# Altium schematic sheet AMS_Solar.SchDoc
size A
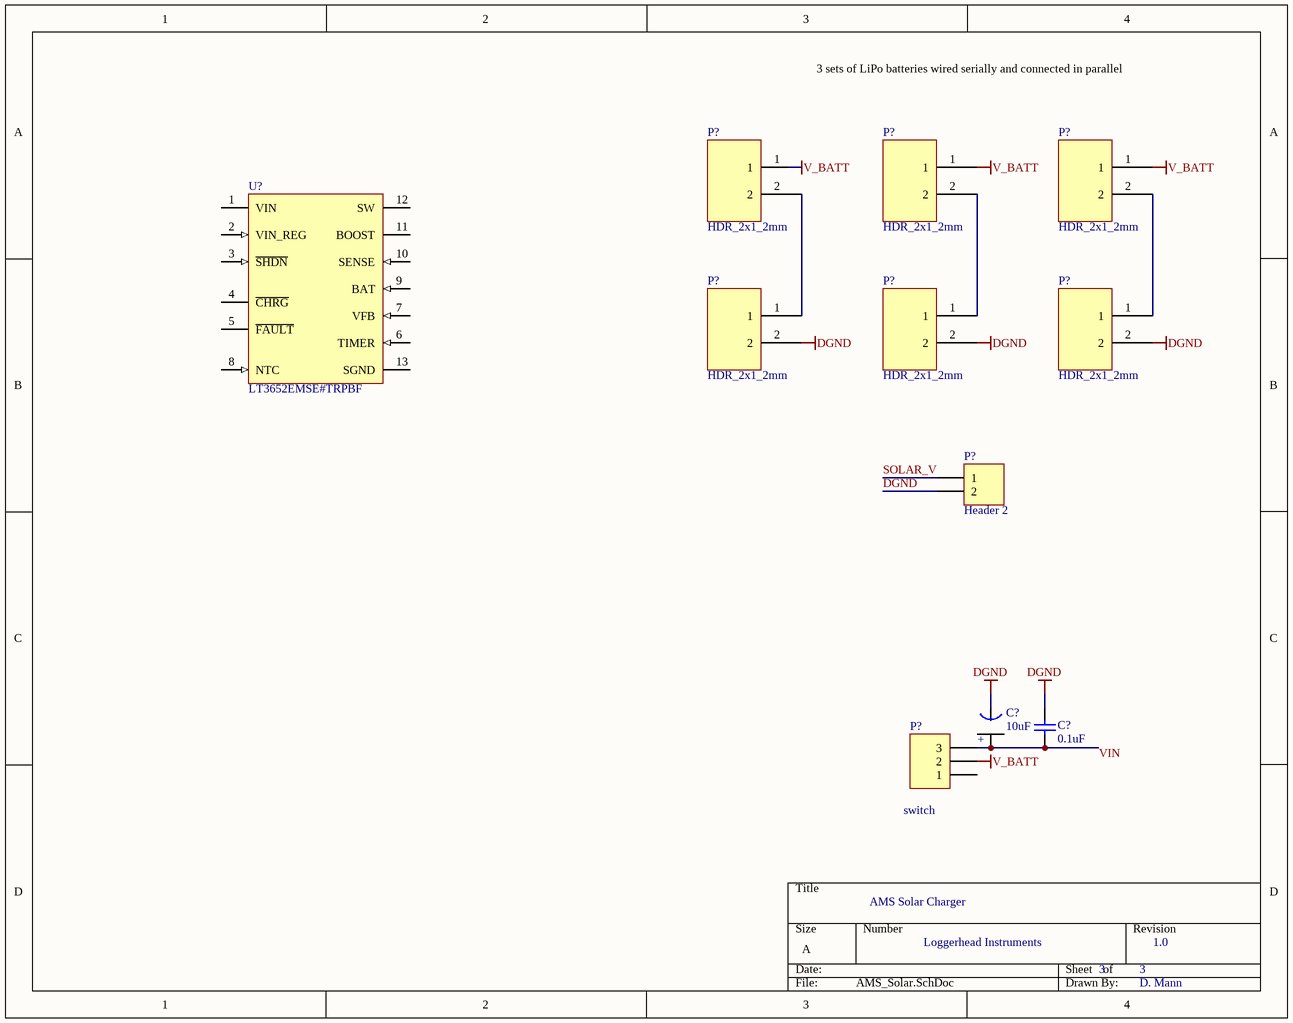
[diagram p0: AMS_Solar.SchDoc]

## Parts
(Parts that share a designator on the sheet are numbered #1, #2 ... from top to bottom, then left to right.)
C?#1  0.1uF  [0402]
C?#2  10uF  [Tant0805]
P?#1  HDR_2x1_2mm  [HDR_2x1_2mm]
P?#2  HDR_2x1_2mm  [HDR_2x1_2mm]
P?#3  HDR_2x1_2mm  [HDR_2x1_2mm]
P?#4  HDR_2x1_2mm  [HDR_2x1_2mm]
P?#5  HDR_2x1_2mm  [HDR_2x1_2mm]
P?#6  HDR_2x1_2mm  [HDR_2x1_2mm]
P?#7  Header 2  [HDR1X2]
P?#8  switch  [HDR1X3]
U?  LT3652EMSE#TRPBF  [LT-MSE-12-EDP_N]

## Nets
DGND: C?#1.2 C?#2.1(GND) P?#4.2 P?#5.2 P?#6.2 P?#7.2
V_BATT: P?#1.1 P?#2.1 P?#3.1 P?#8.2
SOLAR_V: P?#7.1
NetC?#1_1: C?#1.1 C?#2.2(+) P?#8.3
NetP?#1_2: P?#1.2 P?#4.1
NetP?#2_2: P?#2.2 P?#5.1
NetP?#3_2: P?#3.2 P?#6.1

Not connected (* = marked no-connect by the designer): P?#8 1; U? 1(VIN) 2(VIN_REG) 3(~{SHDN}) 4(~{CHRG}) 5(~{FAULT}) 6(TIMER) 7(VFB) 8(NTC) 9(BAT) 10(SENSE) 11(BOOST) 12(SW) 13(SGND)

## Notes on the sheet
- 3 sets of LiPo batteries wired serially and connected in parallel
- AMS Solar Charger
- Loggerhead Instruments
- 3
- 1.0
- D. Mann
- Labels drawn without touching a wire or pin: VIN

## Library data of the parts
C?#1 = C0402: Ceramic Chip Capacitor - Standard; Note: Footprint corresponds to dimensions for bulk cassette packaging. This case size has tightened tolerances.; Published: 17-Jul-2002; LatestRevisionDate: 19-Mar-2004; LatestRevisionNote: Silkscreen size reduced.; DatasheetDocument: Mar-2001; PackageDocument: Mar-2001; PackageReference: 0402; Publisher: Altium Limited; Code_JEITA: 0402; Code_IPC: 1005 [0402]; ComponentLink1Description: Manufacturer Link; ComponentLink1URL: http://www.kemet.com/; ComponentLink2Description: Datasheet; ComponentLink2URL: http://www.kemet.com/kemet/web/homepage/kechome.nsf/vapubfilesname/F3102TA.pdf/$file/F3102TA.pdf; Value: 0.1uF
C?#2 = Tant0805: Value: 10uF
P?#7 = Header 2: Header, 2-Pin; LatestRevisionDate: 17-Jul-2002; LatestRevisionNote: Re-released for DXP Platform.; Publisher: Altium Limited
P?#8 = Header 3: Header, 3-Pin; LatestRevisionDate: 17-Jul-2002; LatestRevisionNote: Re-released for DXP Platform.; Publisher: Altium Limited
U? = LT3652EMSE#TRPBF: Power Tracking 2 A Battery Charger for Solar Power, 12-pin SOP (MSE-12-EDP), -40 to 125 degC, Pb-Free, Tape and Reel; Manufacturer: Linear Technology; Number of Outputs: 1; Vin Max(V): 32; Vin Min(V): 4.95; DatasheetVersion: Rev. D; PackageVersion: Rev. G, 05/2013; PackageReference: MSE-12-EDP; PackageDescription: 12-Pin Plastic MSOP, Exposed Die Pad, Body 4.039 x 3 mm, Pitch 0.65 mm; Supplier 1: Digi-Key; Supplier Part Number 1: LT3652EMSE#TRPBF-ND; Supplier 2: Newark; Supplier Part Number 2: 64R8540; Energy Source: Solar; Packing: Tape and Reel; RoHS: TRUE; Topology: Battery Charger; Mounting Technology: Surface Mount; PartNumber: LT3652EMSE#TRPBF; ComponentLink1Description: Manufacturer URL; ComponentLink1URL: http://www.linear.com/; ComponentLink2Description: Datasheet; ComponentLink2URL: http://cds.linear.com/docs/en/datasheet/3652fd.pdf; ComponentLink3Description: Package Specification; ComponentLink3URL: http://cds.linear.com/docs/en/packaging/05081666_G_MSE12.pdf